# Altium schematic sheet Processor.SchDoc
size C
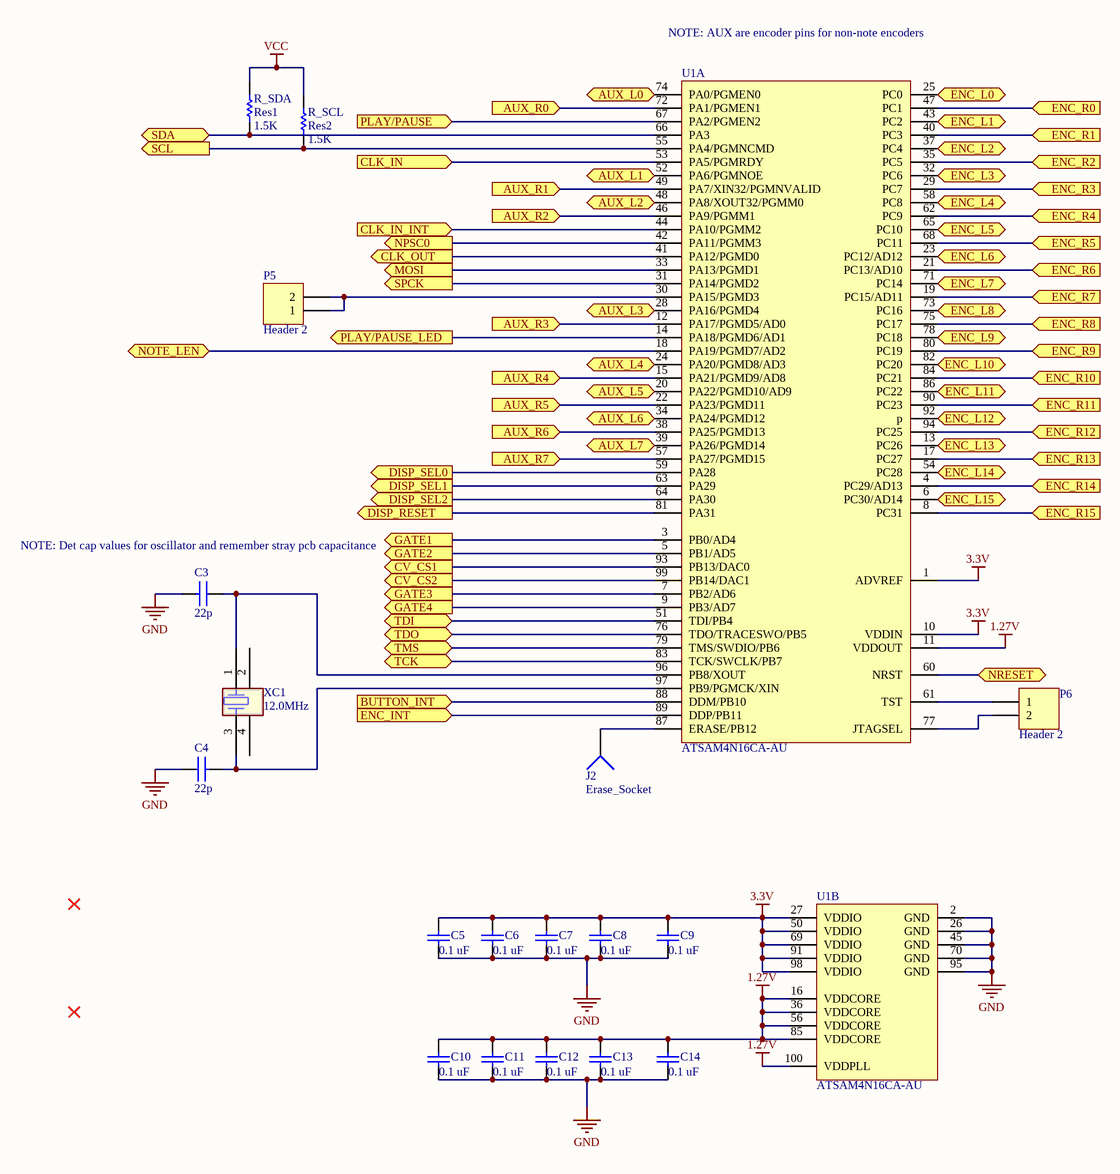
[diagram p0: Processor.SchDoc]

## Parts
C3  value 22p  [AP1-00001]  (hidden comment: CAP-NONPOL)
C4  value 22p  [AP1-00001]  (hidden comment: CAP-NONPOL)
C5  value 0.1 uF  [C0805]
C6  value 0.1 uF  [C0805]
C7  value 0.1 uF  [C0805]
C8  value 0.1 uF  [C0805]
C9  value 0.1 uF  [C0805]
C10  value 0.1 uF  [C0805]
C11  value 0.1 uF  [C0805]
C12  value 0.1 uF  [C0805]
C13  value 0.1 uF  [C0805]
C14  value 0.1 uF  [C0805]
J2  Erase_Socket  [PIN1]
P5  Header 2  [HDR1X2]
P6  Header 2  [HDR1X2]
R_SCL  Res2  value 1.5K  [AXIAL-0.3]
R_SDA  Res1  value 1.5K  [AXIAL-0.3]
U1  ATSAM4N16CA-AU  [LQFP100_N]  (parts A,B of 2)  (net tie)
XC1  12.0MHz  [AP7-00039]

## Ports
AUX_L0 (in), AUX_L1 (in), AUX_L2 (in), AUX_L3 (in), AUX_L4 (in), AUX_L5 (in), AUX_L6 (in), AUX_L7 (in), AUX_R0 (in), AUX_R1 (in), AUX_R2 (in), AUX_R3 (in), AUX_R4 (in), AUX_R5 (in), AUX_R6 (in), AUX_R7 (in), BUTTON_INT (in), CLK_IN (in), CLK_IN_INT (in), CLK_OUT (out), CV_CS1 (out), CV_CS2 (out), DISP_RESET (out), DISP_SEL0 (out), DISP_SEL1 (out), DISP_SEL2 (out), ENC_INT (in), ENC_L0 (in), ENC_L1 (in), ENC_L2 (in), ENC_L3 (in), ENC_L4 (in), ENC_L5 (in), ENC_L6 (in), ENC_L7 (in), ENC_L8 (in), ENC_L9 (in), ENC_L10 (in), ENC_L11 (in), ENC_L12 (in), ENC_L13 (in), ENC_L14 (in), ENC_L15 (in), ENC_R0 (in), ENC_R1 (in), ENC_R2 (in), ENC_R3 (in), ENC_R4 (in), ENC_R5 (in), ENC_R6 (in), ENC_R7 (in), ENC_R8 (in), ENC_R9 (in), ENC_R10 (in), ENC_R11 (in), ENC_R12 (in), ENC_R13 (in), ENC_R14 (in), ENC_R15 (in), GATE1 (out), GATE2 (out), GATE3 (out), GATE4 (out), MOSI (out), NOTE_LEN, NPSC0 (out), NRESET (bidir), PLAY/PAUSE (in), PLAY/PAUSE_LED (out), SCL (out), SDA (bidir), SPCK (out), TCK (bidir), TDI (bidir), TDO (bidir), TMS (bidir)

## Nets
1.27V: C10.2 C11.2 C12.2 C13.2 C14.2 U1.11(VDDOUT) U1.16(VDDCORE) U1.36(VDDCORE) U1.56(VDDCORE) U1.85(VDDCORE) U1.100(VDDPLL)
3.3V: C5.2 C6.2 C7.2 C8.2 C9.2 U1.1(ADVREF) U1.10(VDDIN) U1.27(VDDIO) U1.50(VDDIO) U1.69(VDDIO) U1.91(VDDIO) U1.98(VDDIO)
GND: C3.2 C4.1 C5.1 C6.1 C7.1 C8.1 C9.1 C10.1 C11.1 C12.1 C13.1 C14.1 U1.2(GND) U1.26(GND) U1.45(GND) U1.70(GND) U1.95(GND)
VCC: R_SCL.2 R_SDA.2
AUX_L0: U1.74(PA0/PGMEN0) ; port AUX_L0
AUX_L1: U1.52(PA6/PGMNOE) ; port AUX_L1
AUX_L2: U1.48(PA8/XOUT32/PGMM0) ; port AUX_L2
AUX_L3: U1.28(PA16/PGMD4) ; port AUX_L3
AUX_L4: U1.24(PA20/PGMD8/AD3) ; port AUX_L4
AUX_L5: U1.20(PA22/PGMD10/AD9) ; port AUX_L5
AUX_L6: U1.34(PA24/PGMD12) ; port AUX_L6
AUX_L7: U1.39(PA26/PGMD14) ; port AUX_L7
AUX_R0: U1.72(PA1/PGMEN1) ; port AUX_R0
AUX_R1: U1.49(PA7/XIN32/PGMNVALID) ; port AUX_R1
AUX_R2: U1.46(PA9/PGMM1) ; port AUX_R2
AUX_R3: U1.12(PA17/PGMD5/AD0) ; port AUX_R3
AUX_R4: U1.15(PA21/PGMD9/AD8) ; port AUX_R4
AUX_R5: U1.22(PA23/PGMD11) ; port AUX_R5
AUX_R6: U1.38(PA25/PGMD13) ; port AUX_R6
AUX_R7: U1.57(PA27/PGMD15) ; port AUX_R7
BUTTON_INT: U1.88(DDM/PB10) ; port BUTTON_INT
CLK_IN: U1.53(PA5/PGMRDY) ; port CLK_IN
CLK_IN_INT: U1.44(PA10/PGMM2) ; port CLK_IN_INT
CLK_OUT: U1.41(PA12/PGMD0) ; port CLK_OUT
CV_CS1: U1.93(PB13/DAC0) ; port CV_CS1
CV_CS2: U1.99(PB14/DAC1) ; port CV_CS2
DISP_RESET: U1.81(PA31) ; port DISP_RESET
DISP_SEL0: U1.59(PA28) ; port DISP_SEL0
DISP_SEL1: U1.63(PA29) ; port DISP_SEL1
DISP_SEL2: U1.64(PA30) ; port DISP_SEL2
ENC_INT: U1.89(DDP/PB11) ; port ENC_INT
ENC_L0: U1.25(PC0) ; port ENC_L0
ENC_L1: U1.43(PC2) ; port ENC_L1
ENC_L2: U1.37(PC4) ; port ENC_L2
ENC_L3: U1.32(PC6) ; port ENC_L3
ENC_L4: U1.58(PC8) ; port ENC_L4
ENC_L5: U1.65(PC10) ; port ENC_L5
ENC_L6: U1.23(PC12/AD12) ; port ENC_L6
ENC_L7: U1.71(PC14) ; port ENC_L7
ENC_L8: U1.73(PC16) ; port ENC_L8
ENC_L9: U1.78(PC18) ; port ENC_L9
ENC_L10: U1.82(PC20) ; port ENC_L10
ENC_L11: U1.86(PC22) ; port ENC_L11
ENC_L12: U1.92(p) ; port ENC_L12
ENC_L13: U1.13(PC26) ; port ENC_L13
ENC_L14: U1.54(PC28) ; port ENC_L14
ENC_L15: U1.6(PC30/AD14) ; port ENC_L15
ENC_R0: U1.47(PC1) ; port ENC_R0
ENC_R1: U1.40(PC3) ; port ENC_R1
ENC_R2: U1.35(PC5) ; port ENC_R2
ENC_R3: U1.29(PC7) ; port ENC_R3
ENC_R4: U1.62(PC9) ; port ENC_R4
ENC_R5: U1.68(PC11) ; port ENC_R5
ENC_R6: U1.21(PC13/AD10) ; port ENC_R6
ENC_R7: U1.19(PC15/AD11) ; port ENC_R7
ENC_R8: U1.75(PC17) ; port ENC_R8
ENC_R9: U1.80(PC19) ; port ENC_R9
ENC_R10: U1.84(PC21) ; port ENC_R10
ENC_R11: U1.90(PC23) ; port ENC_R11
ENC_R12: U1.94(PC25) ; port ENC_R12
ENC_R13: U1.17(PC27) ; port ENC_R13
ENC_R14: U1.4(PC29/AD13) ; port ENC_R14
ENC_R15: U1.8(PC31) ; port ENC_R15
GATE1: U1.3(PB0/AD4) ; port GATE1
GATE2: U1.5(PB1/AD5) ; port GATE2
GATE3: U1.7(PB2/AD6) ; port GATE3
GATE4: U1.9(PB3/AD7) ; port GATE4
MOSI: U1.33(PA13/PGMD1) ; port MOSI
NOTE_LEN: U1.18(PA19/PGMD7/AD2) ; port NOTE_LEN
NPSC0: U1.42(PA11/PGMM3) ; port NPSC0
NRESET: U1.60(NRST) ; port NRESET
PLAY/PAUSE: U1.67(PA2/PGMEN2) ; port PLAY/PAUSE
PLAY/PAUSE_LED: U1.14(PA18/PGMD6/AD1) ; port PLAY/PAUSE_LED
SCL: R_SCL.1 U1.55(PA4/PGMNCMD) ; port SCL
SDA: R_SDA.1 U1.66(PA3) ; port SDA
SPCK: U1.31(PA14/PGMD2) ; port SPCK
TCK: U1.83(TCK/SWCLK/PB7) ; port TCK
TDI: U1.51(TDI/PB4) ; port TDI
TDO: U1.76(TDO/TRACESWO/PB5) ; port TDO
TMS: U1.79(TMS/SWDIO/PB6) ; port TMS
NetC3_1: C3.1 U1.96(PB8/XOUT) XC1.1
NetC4_2: C4.2 U1.97(PB9/PGMCK/XIN) XC1.3
NetJ2_1: J2.1 U1.87(ERASE/PB12)
NetP5_1: P5.1 P5.2 U1.30(PA15/PGMD3)
NetP6_1: P6.1 U1.61(TST)
NetP6_2: P6.2 U1.77(JTAGSEL)

Not connected (* = marked no-connect by the designer): XC1 2 4

## Notes on the sheet
- NOTE: AUX are encoder pins for non-note encoders
- (near C3) NOTE: Det cap values for oscillator and remember stray pcb capacitance

## Library data of the parts
C3 C4 = A01-0019: Ceramic capacitor, SMD 0402, NP0, 50V, +/-5%; PartGroup: Capacitors,Ceramic,SMD 0402; TemperatureRange: -55 - +125 deg C; AN: A01-0019; Tolerance: 50V, +/-5%; Height: 0.550000011920929
C5-C14 = Cap: Capacitor; Published: 8-Jun-2000; LatestRevisionDate: 17-Jul-2002; LatestRevisionNote: Re-released for DXP Platform.; PackageReference: RAD-0.3; Publisher: Altium Limited; PackageDescription: Radial Cap, Thru-Hole; 2 Leads; 0.3 in Pin Spacing
J2 = Socket: LatestRevisionDate: 17-Jul-2002; LatestRevisionNote: Re-released for DXP Platform.; Publisher: Altium Limited
P5 P6 = Header 2: Header, 2-Pin; LatestRevisionDate: 17-Jul-2002; LatestRevisionNote: Re-released for DXP Platform.; Publisher: Altium Limited
R_SCL R_SDA = Res1: Resistor; Published: 8-Jun-2000; LatestRevisionDate: 17-Jul-2002; LatestRevisionNote: Re-released for DXP Platform.; PackageReference: AXIAL-0.3; Publisher: Altium Limited; PackageDescription: Axial Device, Thru-Hole; 2 Leads; 0.3 in Pin Spacing
U1 = ATSAM4S16CA-AU: AT91 ARM Cortex-M4 32-bit Microcontroller, 1MB Flash, 128KB SRAM, USB, 79 User I/Os, 100-Pin LQFP, Industrial Grade (-40°C to 105°C), Pb-Free; DatasheetVersion: revA, Oct-2011; PackageVersion: Apr-2006; PackageReference: LQFP100; PackageDescription: 100-Pin Thin Quad Flat Pack 0.5 mm Pitch; Code_JEDEC: MS-026-BED; ComponentLink1Description: Manufacturer URL; ComponentLink1URL: http://www.atmel.com/; ComponentLink2Description: SAM4S Series Datasheet; ComponentLink2URL: http://www.atmel.com/dyn/resources/prod_documents/11100.pdf; ComponentLink3Description: SAM4S Series Summary; ComponentLink3URL: http://www.atmel.com/dyn/resources/prod_documents/11100S.pdf
XC1 = A07-0042: Fox FQ5032B 12.0MHz SMD crystal 738B-12; PartGroup: Frequency devices,Crystals,SMD; Manufacturer: Fox  Electronics; MPN: FQ5032B-12-C-C-C-200-1; Tolerance: 30PPM; AN: A07-0042; Value: 12.0MHz; Height: 1,20000004768372